# Altium schematic sheet SAMD.SchDoc
size OrCAD C; SheetNumber: 5; SheetTotal: 7
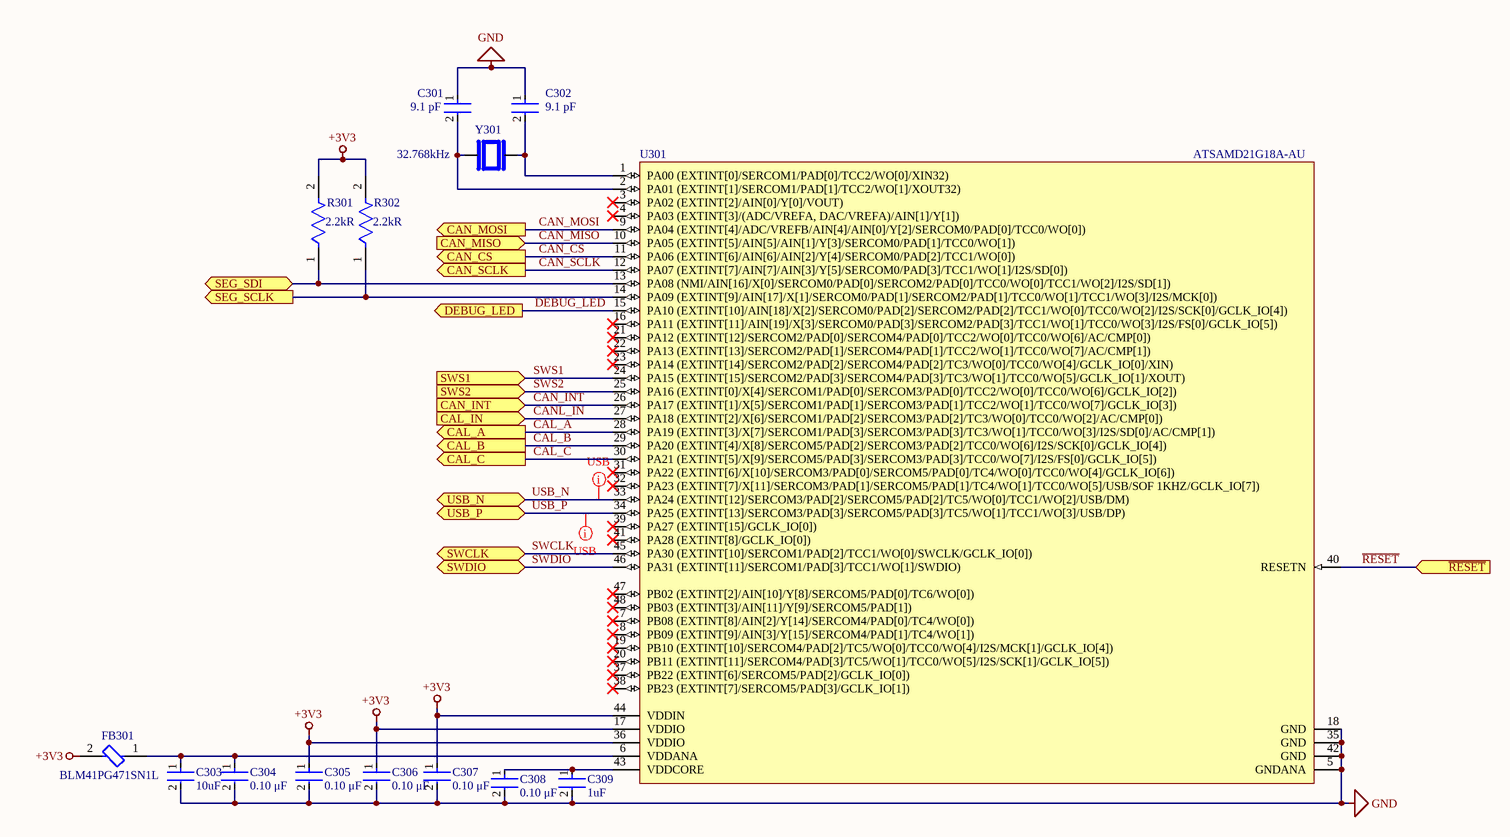
[diagram p0: SAMD.SchDoc]

## Parts
C301  Capacitance: 9.1 pF  [FP-C0402-BB-MFG]  (hidden comment: C0402C919C5GAC7867)
C302  Capacitance: 9.1 pF  [FP-C0402-BB-MFG]  (hidden comment: C0402C919C5GAC7867)
C303  Capacitance: 10uF  [FP-C1206C-EH-MFG]  (hidden comment: C1206C106K4RACAUTO)
C304  Capacitance: 0.10 μF  [FP-C0603C-CF-MFG]  (hidden comment: C0603C104K5RACAUTO)
C305  Capacitance: 0.10 μF  [FP-C0603C-CF-MFG]  (hidden comment: C0603C104K5RACAUTO)
C306  Capacitance: 0.10 μF  [FP-C0603C-CF-MFG]  (hidden comment: C0603C104K5RACAUTO)
C307  Capacitance: 0.10 μF  [FP-C0603C-CF-MFG]  (hidden comment: C0603C104K5RACAUTO)
C308  Capacitance: 0.10 μF  [FP-C0603C-CF-MFG]  (hidden comment: C0603C104K5RACAUTO)
C309  Capacitance: 1uF  [FP-C0603C-CJ-MFG]  (hidden comment: C0603C105K4RACAUTO)
FB301  BLM41PG471SN1L  [FP-BLM41-0_2-a1_2-IPC_B]
R301  Resistance: 2.2kR  [FP-CRCW0805-e3-IPC_B]  (hidden comment: CRCW08052K20FKEA)
R302  Resistance: 2.2kR  [FP-CRCW0805-e3-IPC_B]  (hidden comment: CRCW08052K20FKEA)
U301  ATSAMD21G18A-AU  [ATML-TQFP48_M]
Y301  value 32.768kHz  [XTAL_MS1V-T1K-32.768KHZ-9PF-20PPM-TA-QC-AU]  (hidden comment: MS1V-T1K-32.768KHZ-9PF-20PPM-TA-QC-AU)

## Ports
CAL_A (out), CAL_B (out), CAL_C (out), CAL_IN (in), CAN_CS (out), CAN_INT (in), CAN_MISO (in), CAN_MOSI (out), CAN_SCLK (out), DEBUG_LED (out), SEG_SCLK (out), SEG_SDI (bidir), SWCLK (bidir), SWDIO (bidir), SWS1 (in), SWS2 (in), USB_N (bidir), USB_P (bidir), ~{RESET} (in)

## Nets
+3V3: C305.1 C306.1 C307.1 FB301.2 R301.2 R302.2 U301.17(VDDIO) U301.36(VDDIO) U301.44(VDDIN)
GND: C301.1 C302.1 C303.2 C304.2 C305.2 C306.2 C307.2 C308.2 C309.2 U301.5(GNDANA) U301.18(GND) U301.35(GND) U301.42(GND)
CAL_A: U301.28(PA19_(EXTINT[3]/X[7]/SERCOM1/PAD[3]/SERCOM3/PAD[3]/TC3/WO[1]/TCC0/WO[3]/I2S/SD[0]/AC/CMP[1])) ; port CAL_A
CAL_B: U301.29(PA20_(EXTINT[4]/X[8]/SERCOM5/PAD[2]/SERCOM3/PAD[2]/TCC0/WO[6]/I2S/SCK[0]/GCLK_IO[4])) ; port CAL_B
CAL_C: U301.30(PA21_(EXTINT[5]/X[9]/SERCOM5/PAD[3]/SERCOM3/PAD[3]/TCC0/WO[7]/I2S/FS[0]/GCLK_IO[5])) ; port CAL_C
CAN_CS: U301.11(PA06_(EXTINT[6]/AIN[6]/AIN[2]/Y[4]/SERCOM0/PAD[2]/TCC1/WO[0])) ; port CAN_CS
CAN_INT: U301.26(PA17_(EXTINT[1]/X[5]/SERCOM1/PAD[1]/SERCOM3/PAD[1]/TCC2/WO[1]/TCC0/WO[7]/GCLK_IO[3])) ; port CAN_INT
CAN_MISO: U301.10(PA05_(EXTINT[5]/AIN[5]/AIN[1]/Y[3]/SERCOM0/PAD[1]/TCC0/WO[1])) ; port CAN_MISO
CAN_MOSI: U301.9(PA04_(EXTINT[4]/ADC/VREFB/AIN[4]/AIN[0]/Y[2]/SERCOM0/PAD[0]/TCC0/WO[0])) ; port CAN_MOSI
CAN_SCLK: U301.12(PA07_(EXTINT[7]/AIN[7]/AIN[3]/Y[5]/SERCOM0/PAD[3]/TCC1/WO[1]/I2S/SD[0])) ; port CAN_SCLK
CANL_IN: U301.27(PA18_(EXTINT[2]/X[6]/SERCOM1/PAD[2]/SERCOM3/PAD[2]/TC3/WO[0]/TCC0/WO[2]/AC/CMP[0])) ; port CAL_IN
DEBUG_LED: U301.15(PA10_(EXTINT[10]/AIN[18]/X[2]/SERCOM0/PAD[2]/SERCOM2/PAD[2]/TCC1/WO[0]/TCC0/WO[2]/I2S/SCK[0]/GCLK_IO[4])) ; port DEBUG_LED
~{RESET}: U301.40(RESETN) ; port ~{RESET}
SEG_SCLK: R302.1 U301.14(PA09_(EXTINT[9]/AIN[17]/X[1]/SERCOM0/PAD[1]/SERCOM2/PAD[1]/TCC0/WO[1]/TCC1/WO[3]/I2S/MCK[0])) ; port SEG_SCLK
SEG_SDI: R301.1 U301.13(PA08_(NMI/AIN[16]/X[0]/SERCOM0/PAD[0]/SERCOM2/PAD[0]/TCC0/WO[0]/TCC1/WO[2]/I2S/SD[1])) ; port SEG_SDI
SWCLK: U301.45(PA30_(EXTINT[10]/SERCOM1/PAD[2]/TCC1/WO[0]/SWCLK/GCLK_IO[0])) ; port SWCLK
SWDIO: U301.46(PA31_(EXTINT[11]/SERCOM1/PAD[3]/TCC1/WO[1]/SWDIO)) ; port SWDIO
SWS1: U301.24(PA15_(EXTINT[15]/SERCOM2/PAD[3]/SERCOM4/PAD[3]/TC3/WO[1]/TCC0/WO[5]/GCLK_IO[1]/XOUT)) ; port SWS1
SWS2: U301.25(PA16_(EXTINT[0]/X[4]/SERCOM1/PAD[0]/SERCOM3/PAD[0]/TCC2/WO[0]/TCC0/WO[6]/GCLK_IO[2])) ; port SWS2
USB_N: U301.33(PA24_(EXTINT[12]/SERCOM3/PAD[2]/SERCOM5/PAD[2]/TC5/WO[0]/TCC1/WO[2]/USB/DM)) ; port USB_N
USB_P: U301.34(PA25_(EXTINT[13]/SERCOM3/PAD[3]/SERCOM5/PAD[3]/TC5/WO[1]/TCC1/WO[3]/USB/DP)) ; port USB_P
NetC301_2: C301.2 U301.2(PA01_(EXTINT[1]/SERCOM1/PAD[1]/TCC2/WO[1]/XOUT32)) Y301.1
NetC302_2: C302.2 U301.1(PA00_(EXTINT[0]/SERCOM1/PAD[0]/TCC2/WO[0]/XIN32)) Y301.2
NetC303_1: C303.1 C304.1 FB301.1 U301.6(VDDANA)
NetC308_1: C308.1 C309.1 U301.43(VDDCORE)

Not connected (* = marked no-connect by the designer): U301 3(PA02_(EXTINT[2]/AIN[0]/Y[0]/VOUT))* 4(PA03_(EXTINT[3]/(ADC/VREFA,_DAC/VREFA)/AIN[1]/Y[1]))* 7(PB08_(EXTINT[8]/AIN[2]/Y[14]/SERCOM4/PAD[0]/TC4/WO[0]))* 8(PB09_(EXTINT[9]/AIN[3]/Y[15]/SERCOM4/PAD[1]/TC4/WO[1]))* 16(PA11_(EXTINT[11]/AIN[19]/X[3]/SERCOM0/PAD[3]/SERCOM2/PAD[3]/TCC1/WO[1]/TCC0/WO[3]/I2S/FS[0]/GCLK_IO[5]))* 19(PB10_(EXTINT[10]/SERCOM4/PAD[2]/TC5/WO[0]/TCC0/WO[4]/I2S/MCK[1]/GCLK_IO[4]))* 20(PB11_(EXTINT[11]/SERCOM4/PAD[3]/TC5/WO[1]/TCC0/WO[5]/I2S/SCK[1]/GCLK_IO[5]))* 21(PA12_(EXTINT[12]/SERCOM2/PAD[0]/SERCOM4/PAD[0]/TCC2/WO[0]/TCC0/WO[6]/AC/CMP[0]))* 22(PA13_(EXTINT[13]/SERCOM2/PAD[1]/SERCOM4/PAD[1]/TCC2/WO[1]/TCC0/WO[7]/AC/CMP[1]))* 23(PA14_(EXTINT[14]/SERCOM2/PAD[2]/SERCOM4/PAD[2]/TC3/WO[0]/TCC0/WO[4]/GCLK_IO[0]/XIN))* 31(PA22_(EXTINT[6]/X[10]/SERCOM3/PAD[0]/SERCOM5/PAD[0]/TC4/WO[0]/TCC0/WO[4]/GCLK_IO[6]))* 32(PA23_(EXTINT[7]/X[11]/SERCOM3/PAD[1]/SERCOM5/PAD[1]/TC4/WO[1]/TCC0/WO[5]/USB/SOF_1KHZ/GCLK_IO[7]))* 37(PB22_(EXTINT[6]/SERCOM5/PAD[2]/GCLK_IO[0]))* 38(PB23_(EXTINT[7]/SERCOM5/PAD[3]/GCLK_IO[1]))* 39(PA27_(EXTINT[15]/GCLK_IO[0]))* 41(PA28_(EXTINT[8]/GCLK_IO[0]))* 47(PB02_(EXTINT[2]/AIN[10]/Y[8]/SERCOM5/PAD[0]/TC6/WO[0]))* 48(PB03_(EXTINT[3]/AIN[11]/Y[9]/SERCOM5/PAD[1]))*

## Layout directives
differential pair: USB_N, USB_P

## Library data of the parts
C301 C302 = CMP-03020-023776-1: C0402 9.1 pF C0G 0.25 pF 50 V; Manufacturer: Kemet; Voltage Rating: 50 V; Material: Ceramic; Temperature Coefficient: 15%; Value: 9.1 pF; Tolerance: 0.25 pF; Height: 0.55mm; Octopart: https://octopart.com/c0402c919c5gac7867-kemet-1610064; Category: Cap; Device Class L3: Ceramic Capacitors; Temperature Range Low: -55°C; RoHS: TRUE; Temperature Characteristic: C0G; ComponentLink2URL: https://content.kemet.com/datasheets/KEM_C1002_X7R_SMD.pdf; Lead Free: Yes; Temperature Range High: +125°C; Device Class L1: Passive Components; Manufacturer Part Number: C0402C919C5GAC7867; Device Class L2: Capacitors; ComponentLink2Description: Datasheet; Temperature: -55°C to +125°C; Automotive: No; Ipc Land Pattern Name: CAPC10050X50; Package: C0402-BB
C303 = CMP-03020-003375-1: CAP CER 10UF 16V X7R 1206; Manufacturer: Kemet; Material: Ceramic; Temperature Coefficient: 15%; Tolerance: 10%; Automotive Grade: Grade 1; Manufacturer Part Number: C1206C106K4RACAUTO; Digikey Description: CAP CER 10UF 16V X7R 1206; RoHS: TRUE; Temperature Range Low: -55°C; Ipc Land Pattern Name: CAPC320160X160; Category: Cap; Mouser Description: Multilayer Ceramic Capacitors MLCC - SMD/SMT 10uF 16V 10% AUTO; Device Class L1: Passive Components; Automotive: Yes; ComponentLink2Description: Datasheet; Octopart: https://octopart.com/c1206c106k4racauto-kemet-20072893; Package: C1206C-EH; Temperature: -55°C to +125°C; Device Class L3: Ceramic Capacitors; Device Class L2: Capacitors; Temperature Range High: +125°C; Value: 10uF; Lead Free: Yes; Height: 1.8mm; Temperature Characteristic: X7R; ComponentLink2URL: https://content.kemet.com/datasheets/KEM_C1023_X7R_AUTO_SMD.pdf; Voltage Rating: 16V
C304-C308 = CMP-2006-03060-2: CAP CER 0.1UF 50V X7R 0603; Manufacturer: KEMET; Tolerance: 0.1; Material: Ceramic; Value: 0.10 μF; Automotive Grade: Grade 1; Temperature Coefficient: 30ppm/°C; RoHS: TRUE; Temperature Range Low: -55°C; Automotive: Yes; Octopart: https://octopart.com/c0603c104k5racauto-kemet-12563741; Temperature Characteristic: X7R; Category: Cap; Voltage Rating: 50 V; Mouser Description: Multilayer Ceramic Capacitors MLCC - SMD/SMT 0.1uF 50volts 10% X7R AUTO; ComponentLink2Description: Datasheet; Device Class L2: Capacitors; Digikey Description: CAP CER 0.1UF 50V X7R 0603; Manufacturer Part Number: C0603C104K5RACAUTO; ComponentLink2URL: https://api.kemet.com/component-edge/download/datasheet/C0603C100J5GACAUTO.pdf; Lead Free: Yes; Height: 0.87mm; Device Class L3: Ceramic Capacitors; Device Class L1: Passive Components; Temperature Range High: +125°C; Package: C0603C-CF; Temperature: -55°C to +125°C
C309 = CMP-03020-014193-1: CAP CER 0603 1UF 16V X7R 10%; Manufacturer: KEMET; Temperature Coefficient: 15%; Automotive Grade: Grade 1; Material: Ceramic; Digikey Description: CAP CER 0603 1UF 16V X7R 10%; Octopart: https://octopart.com/c0603c105k4racauto-kemet-91328491; Package: C0603C-CJ; ComponentLink2Description: Datasheet; Mouser Description: Cap Ceramic 1uF 16V X7R 10% Pad SMD 0603 125C Automotive T/R; Automotive: Yes; Tolerance: 10%; Manufacturer Part Number: C0603C105K4RACAUTO; Lead Free: Yes; Temperature: -55°C to +125°C; ComponentLink2URL: https://content.kemet.com/datasheets/KEM_C1023_X7R_AUTO_SMD.pdf; Temperature Range Low: -55°C; Ipc Land Pattern Name: CAPC16080X80; Device Class L1: Passive Components; Temperature Characteristic: X7R; Device Class L2: Capacitors; Height: 0.95mm; Device Class L3: Ceramic Capacitors; RoHS: TRUE; Category: Cap; Temperature Range High: +125°C; Value: 1uF; Voltage Rating: 16V
FB301 = CMP-0686-00760-3: Ferrite Bead, 1806, 470Ω @ 100MHz, 25%, 0.05Ω, 2A; Material: Steel; Number of Circuits: 1; Shielding: Unshielded; DC Resistance (DCR): 50mR; Impedance: 470R; Min Operating Temperature: -55°C; Case/Package: 1806; Packaging: Tape and Reel; DC Current: 2A; Frequency: 100MHz; Length: 4.5mm; Max Operating Temperature: 125°C; Package Quantity: 1; Max Current Rating: 2A; Radiation Hardening: No; RoHS Compliant: Yes; Lead Free: Lead Free; Height: 1.6mm; Test Frequency: 100MHz; Series: BLM41P; Width: 1.6mm; Core Material: Ferrite; Case Code (Imperial): 1806; Termination: SMD/SMT; Tolerance: 25%; Number of Pins: 2; Number of Lines: 1; Case Code (Metric): 4516; Current Rating: 2A; Max DC Current: 2A; DC Resistance-Max: 50mR; Depth: 1.6mm; Military Standard: Not
R301 R302 = CMP-2001-03760-2: RES Thick Film, 2.2kΩ, 1%, 0.125W, 100ppm/°C, 0805; Voltage Rating (DC): 150V; Max Power Dissipation: 125mW; Case/Package: 0805; Width: 1.25mm; Voltage Rating: 150V; Composition: Thick Film; Power Rating: 125mW; Packaging: Tape and Reel; Min Operating Temperature: -55°C; Contact Plating: Tin; Tolerance: 1%; Military Standard: Not; Case Code (Metric): 2012; Radiation Hardening: No; Termination: SMD/SMT; Lead Free: Lead Free; Case Code (Imperial): 0805; Max Operating Temperature: 155°C; Depth: 1.25mm; Weight: 0.000194oz; Number of Terminations: 2; Length: 2mm; Package Quantity: 10; Temperature Coefficient: 100ppm/°C; Features: Automotive AEC-Q200; Height: 0.45mm
U301 = CMP-2100-03585-1: SMART ARM-Based Microcontroller, 1.62 to 3.63 V, 256 KB Flash, 32 KB SRAM, -40 to 85 degC, 48-Pin TQFP, RoHS, Tray; Manufacturer: Atmel; Max Frequency: 48MHz; Number of Timers/Counters: 6; Max Supply Voltage: 3.63V; Min Supply Voltage: 1.62V; Packaging: Tray; Datasheet Version: Rev. N, 10/2016; Datasheet URL: http://www.atmel.com/images/atmel-42181-sam-d21_datasheet.pdf; REACH SVHC: NoSVHC; RoHSCompliant: true; Max Operating Temperature: 85degC; Manufacturer URL: http://www.atmel.com/; Contact Plating: Tin; Frequency: 48MHz; Package Description: 48-Pin Thin Profile Plastic Quad Flat Package, Body 7 x 7 mm, Pitch 0.5 mm; Package Reference: TQFP48; Lead Free: LeadFree; Number of Pins: 48; Min Operating Temperature: -40degC; Case/Package: TQFP; Mount: SurfaceMount
Y301 = MS1V-T1K-32.768KHZ-9PF-20PPM-TA-QC-AU: Tuning Fork Crystal 30 kHz â€“ 200 kHz; MF: {'manufacturer': u'Micro Crystal AG'}; Package: None; MP: MS1V-T1K-32.768KHZ-9PF-20PPM-TA-QC-AU; Availability: Unavailable; Price: None